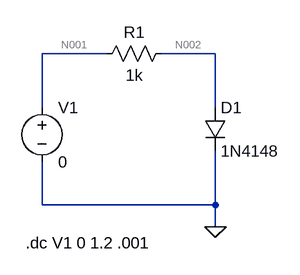
[diagram p0: schematic Diode_FwdBias.asc]
Diode_FwdBias.asc, the LTspice schematic file:
Version 4.1
SHEET 1 880 680
WIRE 192 80 96 80
WIRE 352 80 272 80
WIRE 96 160 96 80
WIRE 352 160 352 80
WIRE 96 304 96 240
WIRE 352 304 352 224
WIRE 352 304 96 304
WIRE 352 336 352 304
FLAG 352 336 0
SYMBOL voltage 96 144 R0
WINDOW 123 0 0 Left 0
WINDOW 39 0 0 Left 0
SYMATTR InstName V1
SYMATTR Value 0
SYMBOL res 288 64 R90
WINDOW 0 0 56 VBottom 2
WINDOW 3 32 56 VTop 2
SYMATTR InstName R1
SYMATTR Value 1k
SYMBOL diode 336 160 R0
SYMATTR InstName D1
SYMATTR Value 1N4148
TEXT 72 360 Left 2 !.dc V1 0 1.2 .001

The netlist it stands for:
* Diode_FwdBias.asc
V1 N001 0 0
R1 N002 N001 1k
D1 N002 0 1N4148
.model D D
.lib standard.dio
.dc V1 0 1.2 .001
.backanno
.end

* Results of the author's LTspice run, read from the files saved beside the schematic
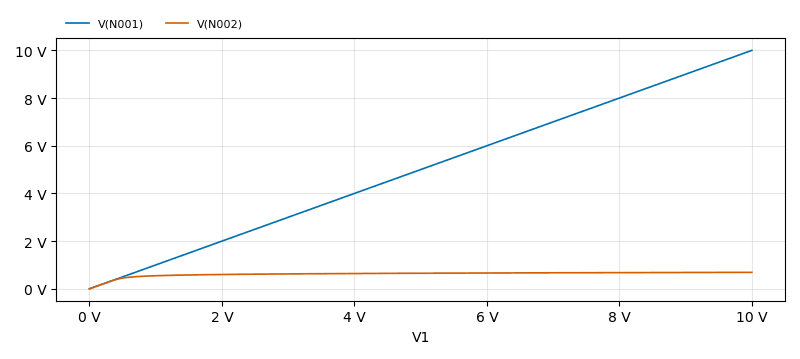
[diagram p1: DC transfer characteristic of Diode_FwdBias.asc, plotted from the saved traces]
* DC transfer characteristic, 1 run:
*   V(N001): 0 V at V1=0 V, 10 V at V1=10 V, min 0 V, max 10 V
*   V(N002): 0 V at V1=0 V, 690.6 mV at V1=10 V, min 0 V, max 690.6 mV